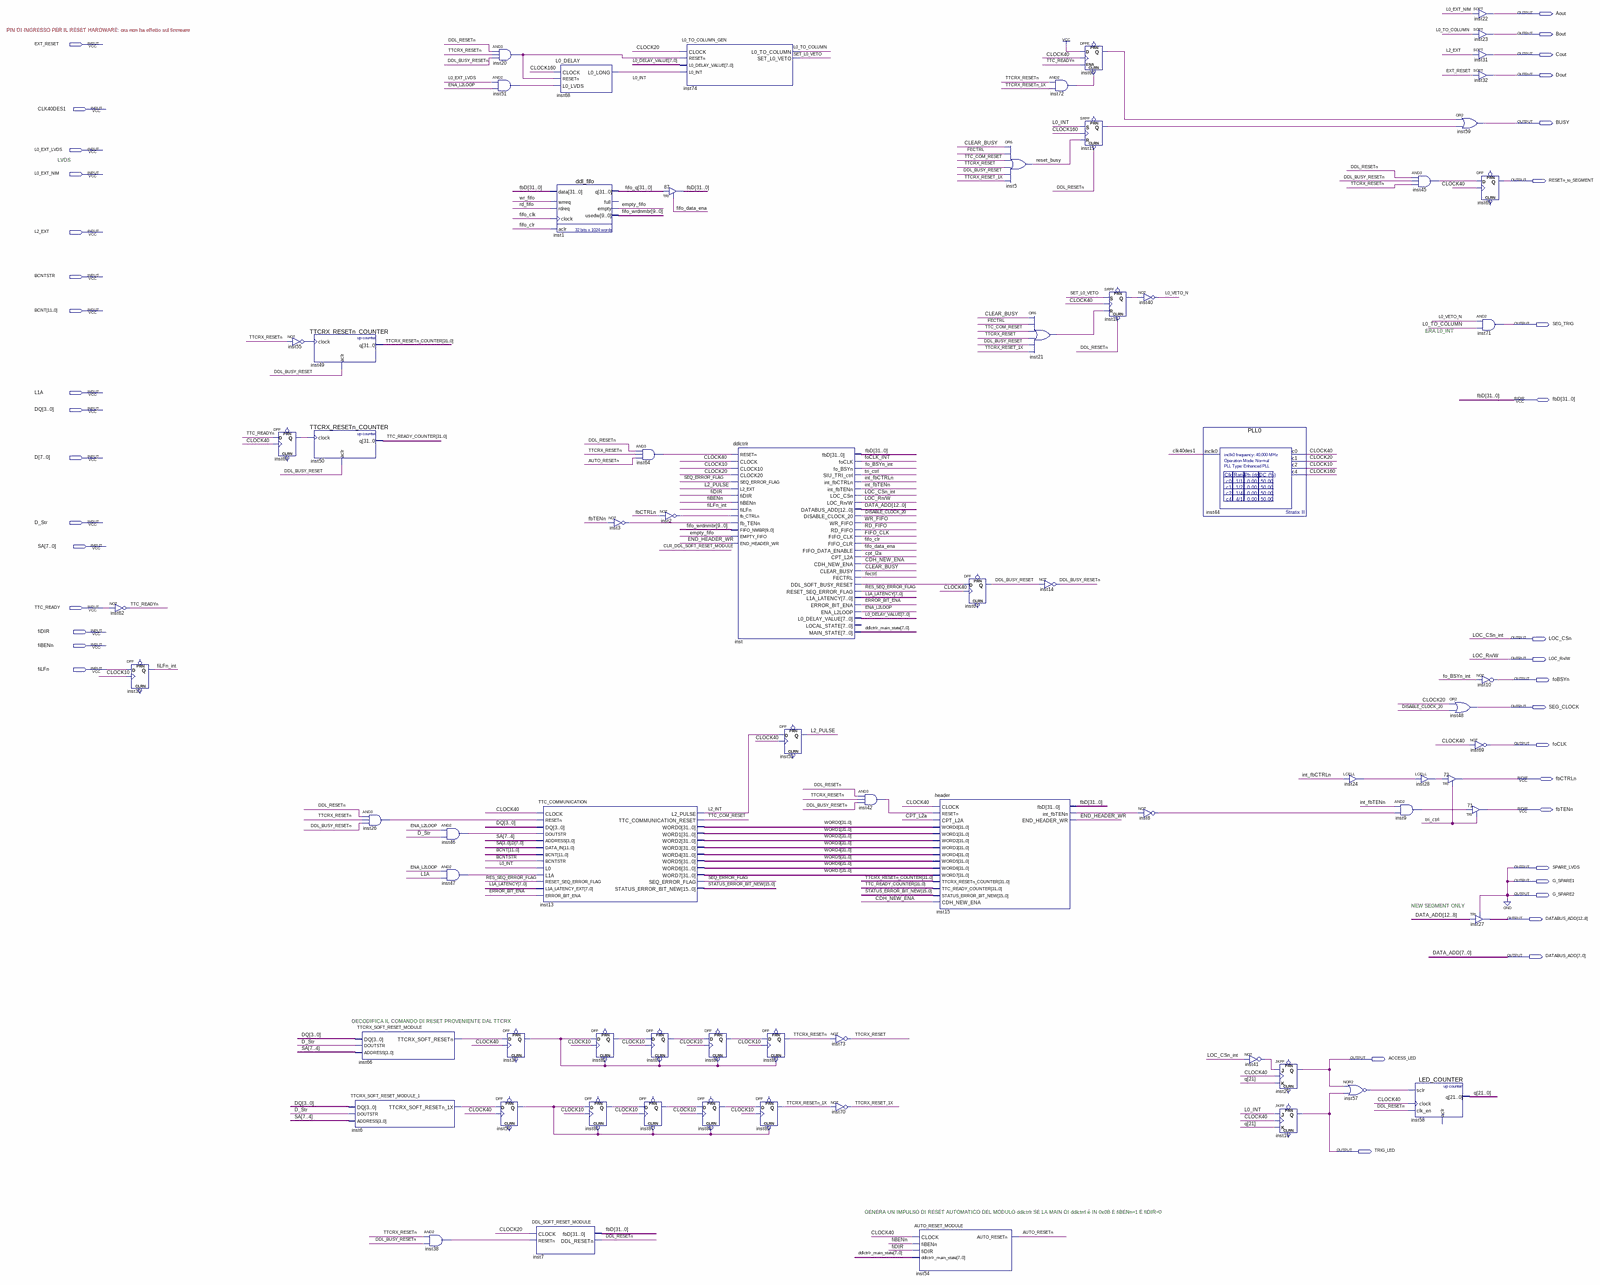
[diagram p0: schematic sheet, whole]
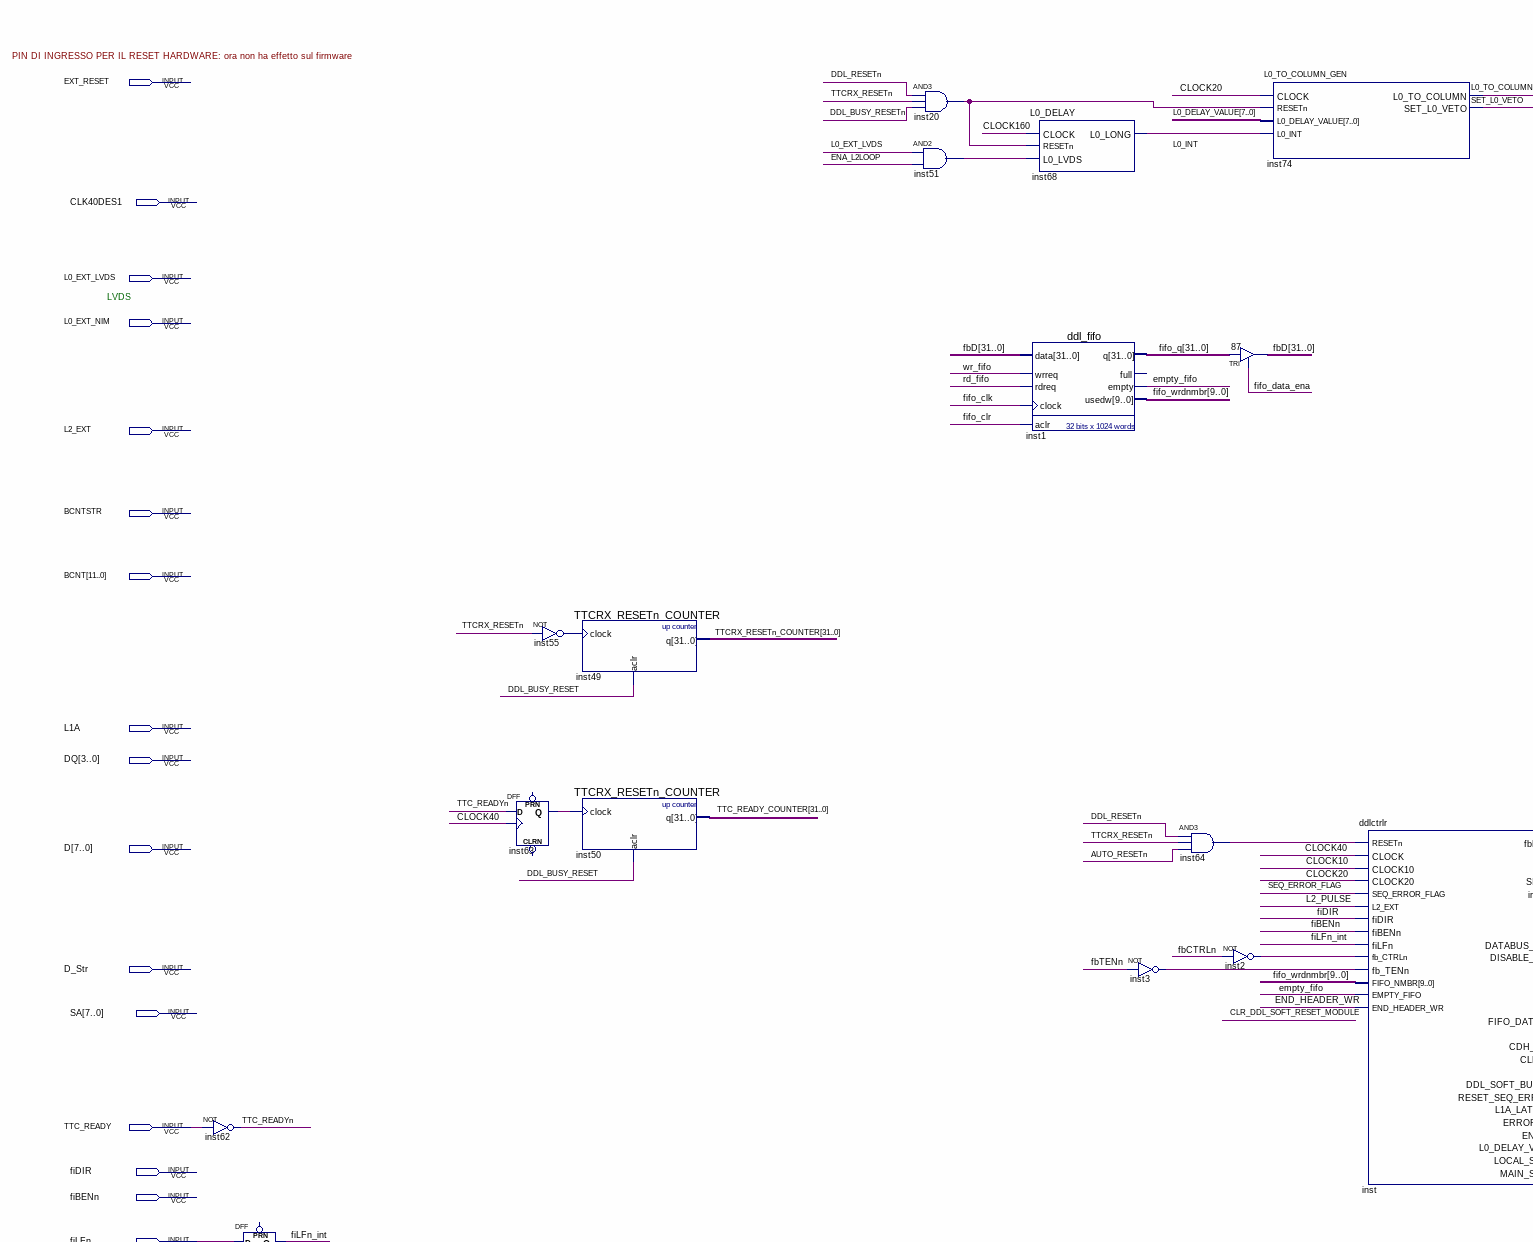
[diagram p1: schematic sheet, upper left part]
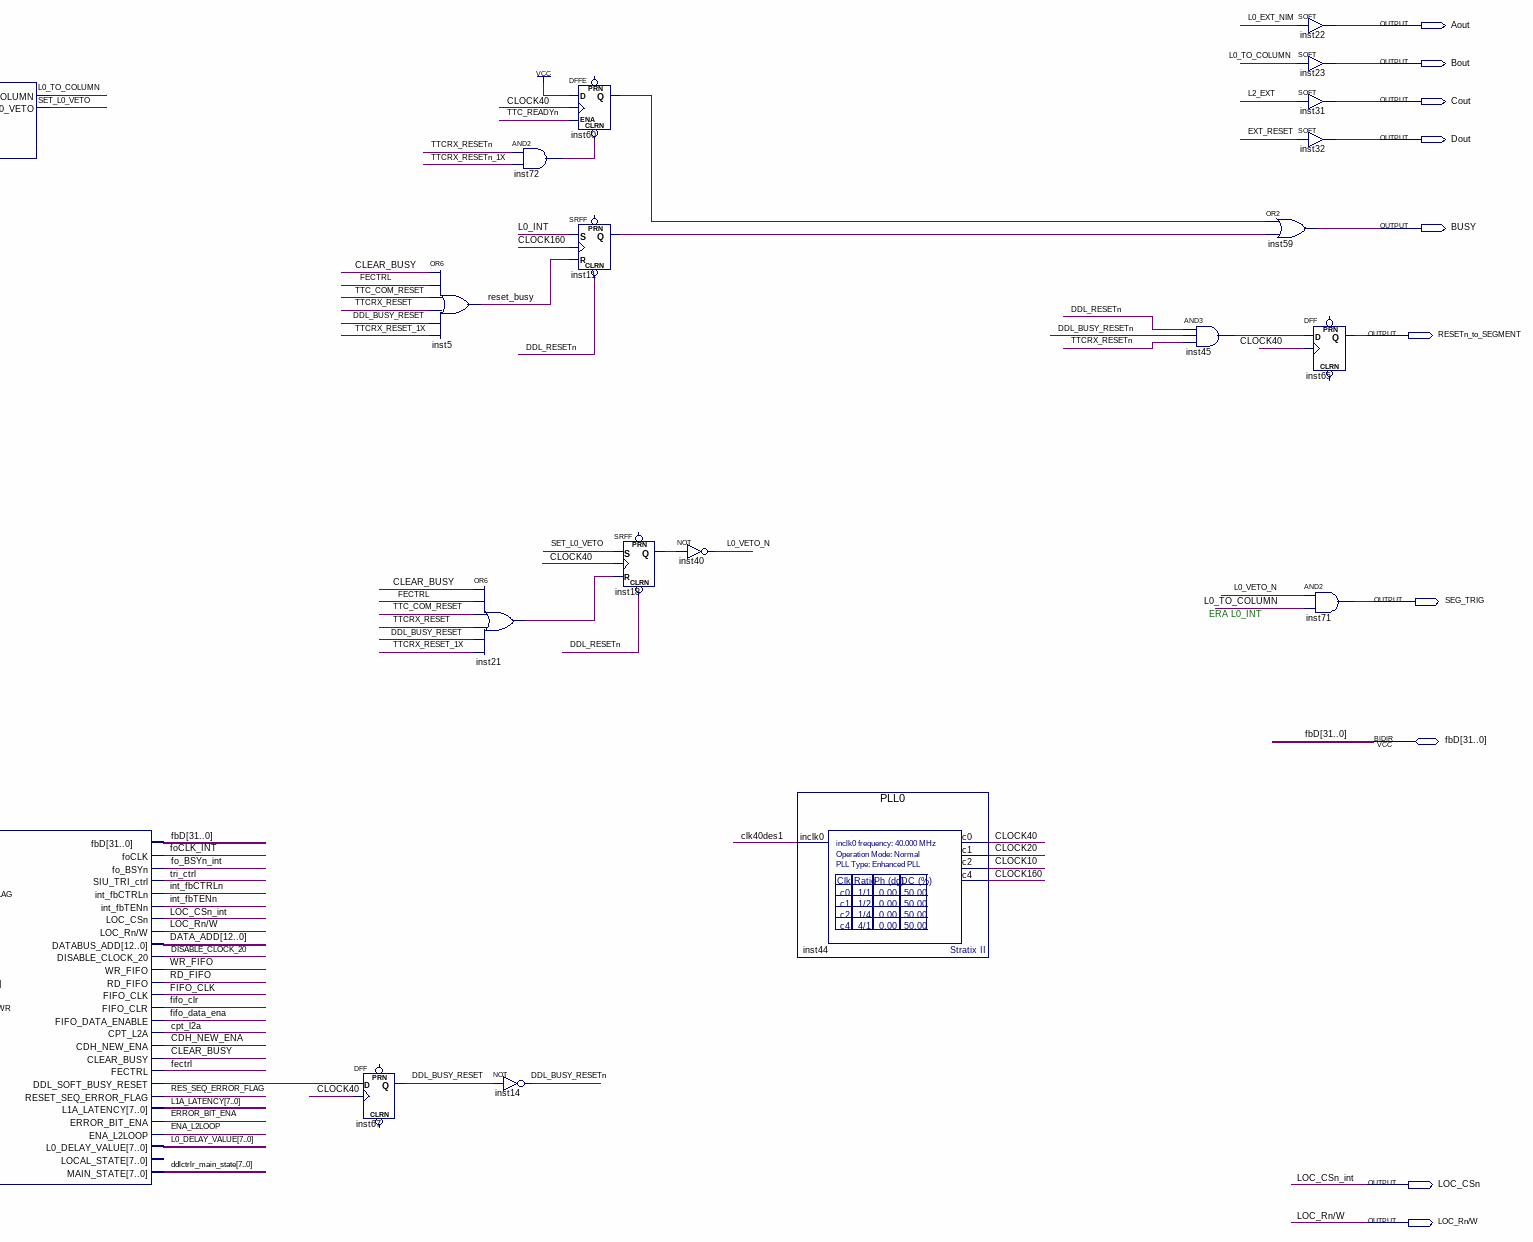
[diagram p2: schematic sheet, upper right part]
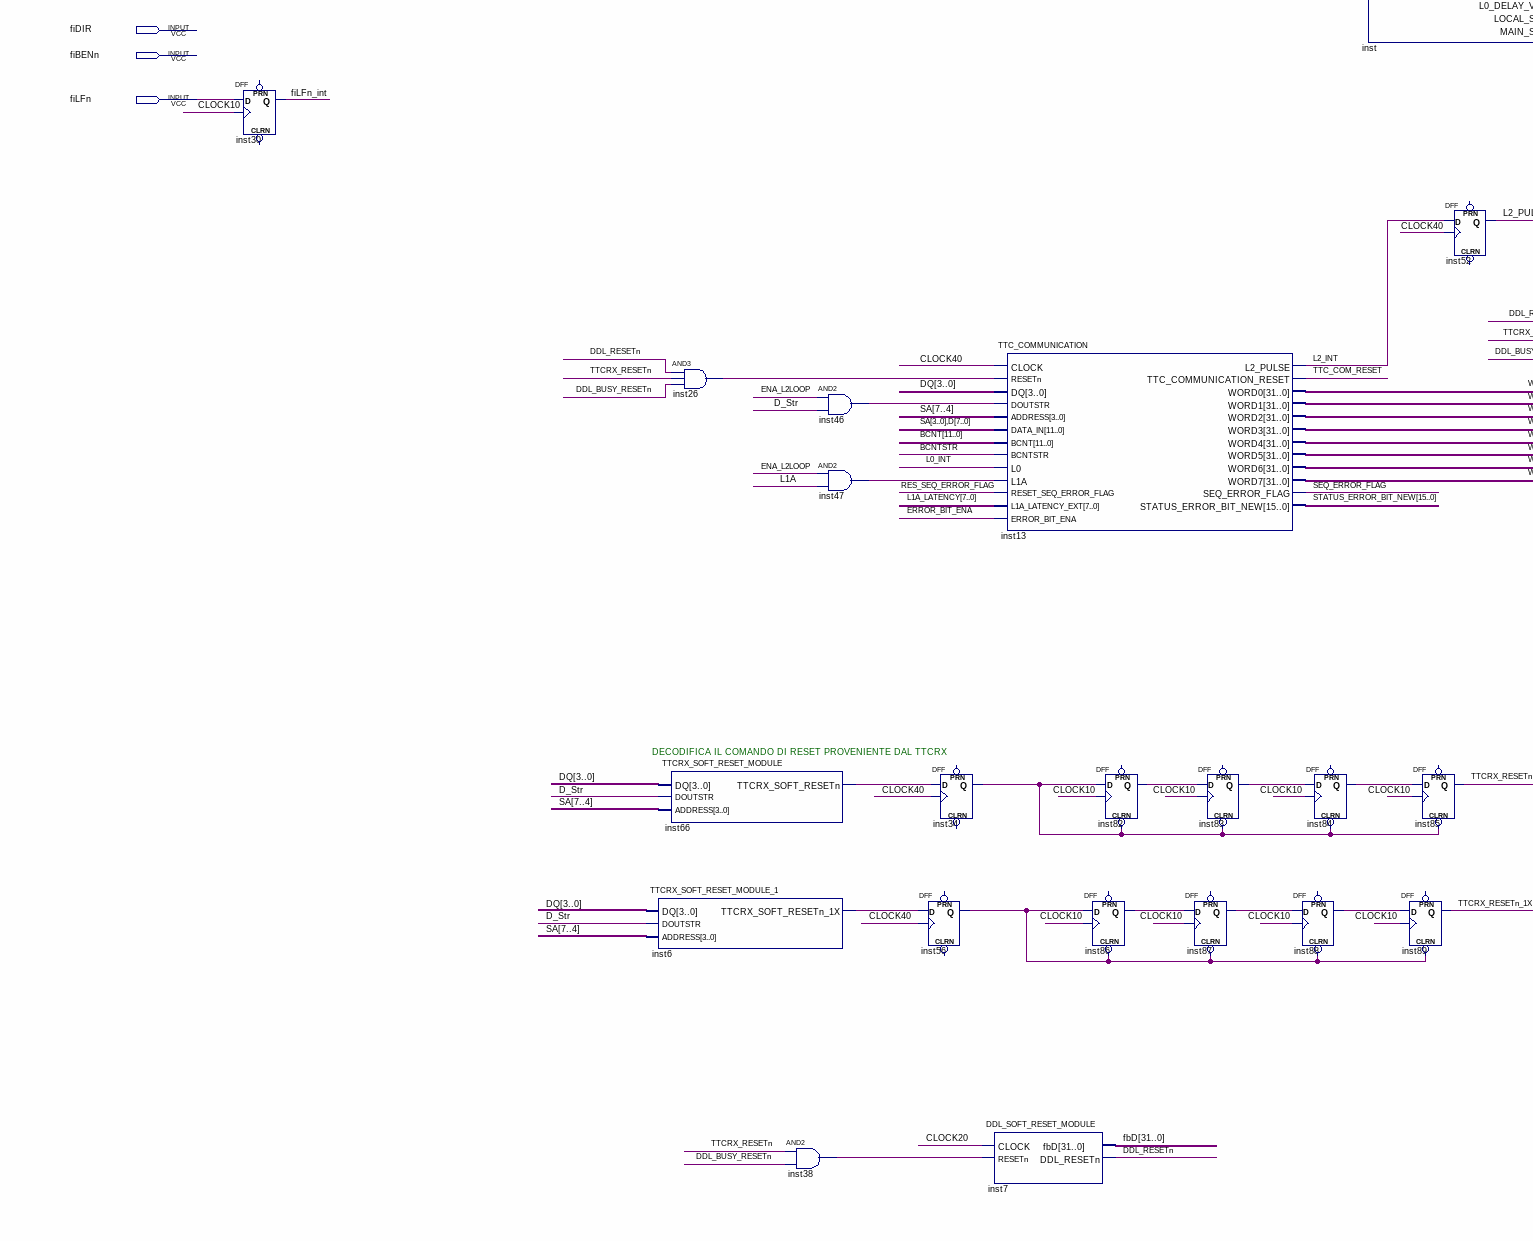
[diagram p3: schematic sheet, lower left part]
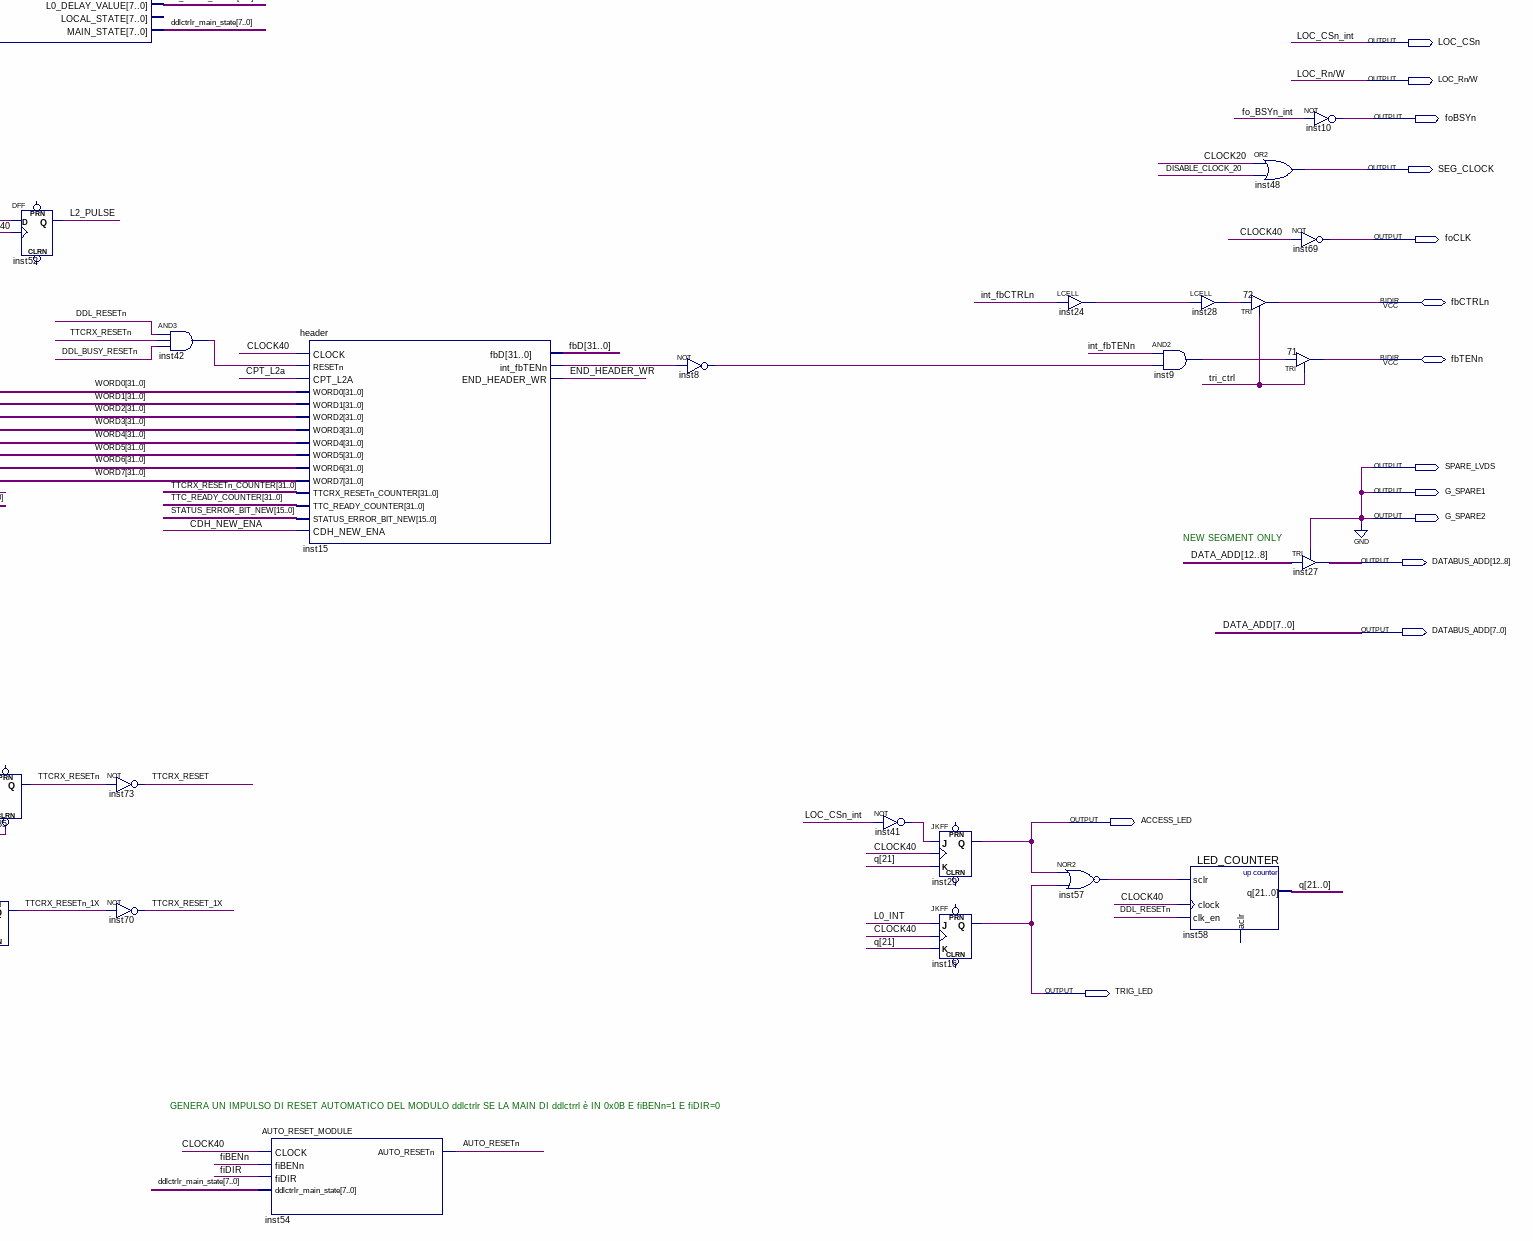
[diagram p4: schematic sheet, lower right part]
// Quartus schematic ddl_ctrlr.bdf as structural Verilog: 73 symbols, 38 pins
module ddl_ctrlr (
  input  EXT_RESET,
  input  CLK40DES1,
  input  L0_EXT_LVDS,
  input  L0_EXT_NIM,
  input  L2_EXT,
  input  BCNTSTR,
  input  [11:0] BCNT,
  input  L1A,
  input  [3:0] DQ,
  input  [7:0] D,
  input  D_Str,
  input  [7:0] SA,
  input  TTC_READY,
  input  fiDIR,
  input  fiBENn,
  input  fiLFn,
  inout  [31:0] fbD,
  inout  fbCTRLn,
  inout  fbTENn,
  output Aout,
  output Bout,
  output Cout,
  output Dout,
  output BUSY,
  output RESETn_to_SEGMENT,
  output SEG_TRIG,
  output LOC_CSn,
  output \LOC_Rn/W ,
  output foBSYn,
  output SEG_CLOCK,
  output foCLK,
  output SPARE_LVDS,
  output G_SPARE1,
  output G_SPARE2,
  output [12:0] DATABUS_ADD,
  output ACCESS_LED,
  output TRIG_LED
);

  wire AUTO_RESETn, CDH_NEW_ENA, CLEAR_BUSY, CLOCK10, CLOCK20, CLOCK40, CLOCK160, CPT_L2a, DDL_BUSY_RESET,
       DDL_BUSY_RESETn, DDL_RESETn, DISABLE_CLOCK_20, empty_fifo, ENA_L2LOOP, END_HEADER_WR, ERROR_BIT_ENA,
       fectrl, FIFO_CLK, fifo_clr, fifo_data_ena, fiLFn_int, fo_BSYn_int, foCLK_INT, inst2_out, inst3_out,
       inst6_ttcrx_soft_resetn_1x, inst8_out, inst9_out, inst11_q, inst15_int_fbtenn, inst18_q, inst20_out,
       inst21_out, inst24_out, inst26_out, inst28_out, inst34_q, inst38_out, inst41_out, inst42_out,
       inst45_out, inst46_out, inst47_out, inst51_out, inst55_out, inst56_q, inst57_out, inst60_q, inst63_q,
       inst64_out, inst66_ttcrx_soft_resetn, inst72_out, inst82_q, inst83_q, inst84_q, inst86_q, inst87_q,
       inst88_q, inst_ddl_soft_busy_reset, int_fbCTRLn, int_fbTENn, L0_INT, L0_TO_COLUMN, L0_VETO_N, L2_INT,
       L2_PULSE, RD_FIFO, RES_SEQ_ERROR_FLAG, reset_busy, SEQ_ERROR_FLAG, SET_L0_VETO, tri_ctrl,
       TTC_COM_RESET, TTC_READYn, TTCRX_RESET, TTCRX_RESET_1X, TTCRX_RESETn, TTCRX_RESETn_1X, WR_FIFO;
  wire [7:0] ddlctrlr_main_state, L0_DELAY_VALUE, L1A_LATENCY;
  wire [9:0] fifo_wrdnmbr;
  wire [12:8] DATA_ADD;
  wire [15:0] STATUS_ERROR_BIT_NEW;
  wire [21:0] q;
  wire [31:0] fifo_q, TTC_READY_COUNTER, TTCRX_RESETn_COUNTER, WORD0, WORD1, WORD2, WORD3, WORD4, WORD5,
       WORD6, WORD7;

  not inst62 (TTC_READYn, TTC_READY);
  DFF inst30 (.CLK(CLOCK10), .D(fiLFn), .Q(fiLFn_int));  // open: CLRN, PRN
  not inst55 (inst55_out, TTCRX_RESETn);
  DFF inst63 (.CLK(CLOCK40), .D(TTC_READYn), .Q(inst63_q));  // open: CLRN, PRN
  TTCRX_RESETn_COUNTER inst49 (.clock(inst55_out), .aclr(DDL_BUSY_RESET), .q(TTCRX_RESETn_COUNTER));
  TTCRX_RESETn_COUNTER inst50 (.clock(inst63_q), .aclr(DDL_BUSY_RESET), .q(TTC_READY_COUNTER));
  and inst26 (inst26_out, DDL_RESETn, TTCRX_RESETn, DDL_BUSY_RESETn);
  TTCRX_SOFT_RESET_MODULE inst66 (
    .DQ(DQ), .DOUTSTR(D_Str), .ADDRESS(SA[7:4]), .TTCRX_SOFT_RESETn(inst66_ttcrx_soft_resetn));
  TTCRX_SOFT_RESET_MODULE_1 inst6 (
    .DQ(DQ), .DOUTSTR(D_Str), .ADDRESS(SA[7:4]), .TTCRX_SOFT_RESETn_1X(inst6_ttcrx_soft_resetn_1x));
  and inst38 (inst38_out, TTCRX_RESETn, DDL_BUSY_RESETn);
  and inst46 (inst46_out, ENA_L2LOOP, D_Str);
  and inst47 (inst47_out, ENA_L2LOOP, L1A);
  and inst20 (inst20_out, DDL_RESETn, TTCRX_RESETn, DDL_BUSY_RESETn);
  and inst51 (inst51_out, L0_EXT_LVDS, ENA_L2LOOP);
  DFF inst34 (.CLK(CLOCK40), .D(inst66_ttcrx_soft_resetn), .Q(inst34_q));  // open: CLRN, PRN
  DFF inst56 (.CLK(CLOCK40), .D(inst6_ttcrx_soft_resetn_1x), .Q(inst56_q));  // open: CLRN, PRN
  DDL_SOFT_RESET_MODULE inst7 (.CLOCK(CLOCK20), .RESETn(inst38_out), .DDL_RESETn(DDL_RESETn), .fbD(fbD));
  L0_DELAY inst68 (.CLOCK(CLOCK160), .RESETn(inst20_out), .L0_LVDS(inst51_out), .L0_LONG(L0_INT));
  ddl_fifo inst1 (
    .data(fbD), .wrreq(WR_FIFO), .rdreq(RD_FIFO), .clock(FIFO_CLK), .aclr(fifo_clr), .q(fifo_q),
    .empty(empty_fifo), .usedw(fifo_wrdnmbr));  // open: full
  TTC_COMMUNICATION inst13 (
    .CLOCK(CLOCK40), .RESETn(inst26_out), .DQ(DQ), .DOUTSTR(inst46_out), .ADDRESS(SA[7:4]),
    .DATA_IN({SA[3:0], D}), .BCNT(BCNT), .BCNTSTR(BCNTSTR), .L0(L0_INT), .L1A(inst47_out),
    .RESET_SEQ_ERROR_FLAG(RES_SEQ_ERROR_FLAG), .L1A_LATENCY_EXT(L1A_LATENCY), .ERROR_BIT_ENA(ERROR_BIT_ENA),
    .L2_PULSE(L2_INT), .TTC_COMMUNICATION_RESET(TTC_COM_RESET), .WORD0(WORD0), .WORD1(WORD1), .WORD2(WORD2),
    .WORD3(WORD3), .WORD4(WORD4), .WORD5(WORD5), .WORD6(WORD6), .WORD7(WORD7),
    .SEQ_ERROR_FLAG(SEQ_ERROR_FLAG), .STATUS_ERROR_BIT_NEW(STATUS_ERROR_BIT_NEW));
  DFF inst86 (.CLRN(inst56_q), .CLK(CLOCK10), .D(inst56_q), .Q(inst86_q));  // open: PRN
  not inst3 (inst3_out, fbTENn);
  DFF inst82 (.CLRN(inst34_q), .CLK(CLOCK10), .D(inst34_q), .Q(inst82_q));  // open: PRN
  and inst64 (inst64_out, DDL_RESETn, TTCRX_RESETn, AUTO_RESETn);
  DFF inst87 (.CLRN(inst56_q), .CLK(CLOCK10), .D(inst86_q), .Q(inst87_q));  // open: PRN
  TRI u_87[31:0] (.IN(fifo_q), .OE(fifo_data_ena), .OUT(fbD));
  not inst2 (inst2_out, fbCTRLn);
  DFF inst83 (.CLRN(inst34_q), .CLK(CLOCK10), .D(inst82_q), .Q(inst83_q));  // open: PRN
  L0_TO_COLUMN_GEN inst74 (
    .CLOCK(CLOCK20), .RESETn(inst20_out), .L0_DELAY_VALUE(L0_DELAY_VALUE), .L0_INT(L0_INT),
    .L0_TO_COLUMN(L0_TO_COLUMN), .SET_L0_VETO(SET_L0_VETO));
  DFF inst88 (.CLRN(inst56_q), .CLK(CLOCK10), .D(inst87_q), .Q(inst88_q));  // open: PRN
  DFF inst84 (.CLRN(inst34_q), .CLK(CLOCK10), .D(inst83_q), .Q(inst84_q));  // open: PRN
  ddlctrlr inst (
    .RESETn(inst64_out), .CLOCK(CLOCK40), .CLOCK10(CLOCK10), .CLOCK20(CLOCK20),
    .SEQ_ERROR_FLAG(SEQ_ERROR_FLAG), .L2_EXT(L2_PULSE), .fiDIR(fiDIR), .fiBENn(fiBENn), .fiLFn(fiLFn_int),
    .fb_CTRLn(inst2_out), .fb_TENn(inst3_out), .FIFO_NMBR(fifo_wrdnmbr), .EMPTY_FIFO(empty_fifo),
    .END_HEADER_WR(END_HEADER_WR), .foCLK(foCLK_INT), .fo_BSYn(fo_BSYn_int), .SIU_TRI_ctrl(tri_ctrl),
    .int_fbCTRLn(int_fbCTRLn), .int_fbTENn(int_fbTENn), .LOC_CSn(LOC_CSn), .\LOC_Rn/W (\LOC_Rn/W ),
    .DATABUS_ADD({DATA_ADD, DATABUS_ADD[7:0]}), .DISABLE_CLOCK_20(DISABLE_CLOCK_20), .WR_FIFO(WR_FIFO),
    .RD_FIFO(RD_FIFO), .FIFO_CLK(FIFO_CLK), .FIFO_CLR(fifo_clr), .FIFO_DATA_ENABLE(fifo_data_ena),
    .CPT_L2A(CPT_L2a), .CDH_NEW_ENA(CDH_NEW_ENA), .CLEAR_BUSY(CLEAR_BUSY), .FECTRL(fectrl),
    .DDL_SOFT_BUSY_RESET(inst_ddl_soft_busy_reset), .RESET_SEQ_ERROR_FLAG(RES_SEQ_ERROR_FLAG),
    .L1A_LATENCY(L1A_LATENCY), .ERROR_BIT_ENA(ERROR_BIT_ENA), .ENA_L2LOOP(ENA_L2LOOP),
    .L0_DELAY_VALUE(L0_DELAY_VALUE), .MAIN_STATE(ddlctrlr_main_state), .fbD(fbD));  // open: LOCAL_STATE
  DFF inst52 (.CLK(CLOCK40), .D(L2_INT), .Q(L2_PULSE));  // open: CLRN, PRN
  DFF inst85 (.CLRN(inst34_q), .CLK(CLOCK10), .D(inst84_q), .Q(TTCRX_RESETn));  // open: PRN
  DFF inst89 (.CLRN(inst56_q), .CLK(CLOCK10), .D(inst88_q), .Q(TTCRX_RESETn_1X));  // open: PRN
  not inst73 (TTCRX_RESET, TTCRX_RESETn);
  not inst70 (TTCRX_RESET_1X, TTCRX_RESETn_1X);
  and inst42 (inst42_out, DDL_RESETn, TTCRX_RESETn, DDL_BUSY_RESETn);
  AUTO_RESET_MODULE inst54 (
    .CLOCK(CLOCK40), .fiBENn(fiBENn), .fiDIR(fiDIR), .ddlctrlr_main_state(ddlctrlr_main_state),
    .AUTO_RESETn(AUTO_RESETn));
  header inst15 (
    .CLOCK(CLOCK40), .RESETn(inst42_out), .CPT_L2A(CPT_L2a), .WORD0(WORD0), .WORD1(WORD1), .WORD2(WORD2),
    .WORD3(WORD3), .WORD4(WORD4), .WORD5(WORD5), .WORD6(WORD6), .WORD7(WORD7),
    .TTCRX_RESETn_COUNTER(TTCRX_RESETn_COUNTER), .TTC_READY_COUNTER(TTC_READY_COUNTER),
    .STATUS_ERROR_BIT_NEW(STATUS_ERROR_BIT_NEW), .CDH_NEW_ENA(CDH_NEW_ENA), .int_fbTENn(inst15_int_fbtenn),
    .END_HEADER_WR(END_HEADER_WR), .fbD(fbD));
  DFF inst67 (.CLK(CLOCK40), .D(inst_ddl_soft_busy_reset), .Q(DDL_BUSY_RESET));  // open: CLRN, PRN
  or inst5 (reset_busy, CLEAR_BUSY, fectrl, TTC_COM_RESET, TTCRX_RESET, DDL_BUSY_RESET, TTCRX_RESET_1X);
  and inst72 (inst72_out, TTCRX_RESETn, TTCRX_RESETn_1X);
  or inst21 (inst21_out, CLEAR_BUSY, fectrl, TTC_COM_RESET, TTCRX_RESET, DDL_BUSY_RESET, TTCRX_RESET_1X);
  not inst14 (DDL_BUSY_RESETn, DDL_BUSY_RESET);
  DFFE inst60 (.CLRN(inst72_out), .D(1'b1), .CLK(CLOCK40), .ENA(TTC_READYn), .Q(inst60_q));  // open: PRN
  SRFF inst11 (.CLRN(DDL_RESETn), .S(L0_INT), .R(reset_busy), .CLK(CLOCK160), .Q(inst11_q));  // open: PRN
  SRFF inst18 (.CLRN(DDL_RESETn), .S(SET_L0_VETO), .R(inst21_out), .CLK(CLOCK40), .Q(inst18_q));  // open: PRN
  not inst40 (L0_VETO_N, inst18_q);
  not inst8 (inst8_out, inst15_int_fbtenn);
  PLL0 inst44 (.inclk0(CLK40DES1), .c0(CLOCK40), .c1(CLOCK20), .c2(CLOCK10), .c4(CLOCK160));
  not inst41 (inst41_out, LOC_CSn);
  JKFF inst29 (.K(q[21]), .J(inst41_out), .CLK(CLOCK40), .Q(ACCESS_LED));  // open: PRN, CLRN
  JKFF inst16 (.K(q[21]), .J(L0_INT), .CLK(CLOCK40), .Q(TRIG_LED));  // open: PRN, CLRN
  LCELL inst24 (.IN(int_fbCTRLn), .OUT(inst24_out));
  nor inst57 (inst57_out, ACCESS_LED, TRIG_LED);
  and inst9 (inst9_out, int_fbTENn, inst8_out);
  LED_COUNTER inst58 (.sclr(inst57_out), .clock(CLOCK40), .clk_en(DDL_RESETn), .q(q));  // open: aclr
  and inst45 (inst45_out, DDL_RESETn, DDL_BUSY_RESETn, TTCRX_RESETn);
  LCELL inst28 (.IN(inst24_out), .OUT(inst28_out));
  or inst59 (BUSY, inst60_q, inst11_q);
  or inst48 (SEG_CLOCK, CLOCK20, DISABLE_CLOCK_20);
  TRI u_72 (.IN(inst28_out), .OE(tri_ctrl), .OUT(fbCTRLn));
  SOFT inst22 (.IN(L0_EXT_NIM), .OUT(Aout));
  SOFT inst23 (.IN(L0_TO_COLUMN), .OUT(Bout));
  SOFT inst31 (.IN(L2_EXT), .OUT(Cout));
  SOFT inst32 (.IN(EXT_RESET), .OUT(Dout));
  DFF inst65 (.CLK(CLOCK40), .D(inst45_out), .Q(RESETn_to_SEGMENT));  // open: CLRN, PRN
  and inst71 (SEG_TRIG, L0_VETO_N, L0_TO_COLUMN);
  not inst10 (foBSYn, fo_BSYn_int);
  not inst69 (foCLK, CLOCK40);
  TRI u_71 (.IN(inst9_out), .OE(tri_ctrl), .OUT(fbTENn));
  TRI inst27[4:0] (.IN(DATA_ADD), .OE(1'b0), .OUT(DATABUS_ADD[12:8]));

  assign G_SPARE1 = 1'b0;
  assign G_SPARE2 = 1'b0;
  assign SPARE_LVDS = 1'b0;

  // Other names for the same wires on the sheet: DATA_ADD[7:0] = DATABUS_ADD[7:0]; LOC_CSn_int = LOC_CSn

  // Notes on the sheet:
  //   PIN DI INGRESSO PER IL RESET HARDWARE: ora non ha effetto sul firmware
  //   LVDS
  //   ERA L0_INT
  //   NEW SEGMENT ONLY
  //   DECODIFICA IL COMANDO DI RESET PROVENIENTE DAL TTCRX
  //   GENERA UN IMPULSO DI RESET AUTOMATICO DEL MODULO ddlctrlr SE LA MAIN DI ddlctrrl è IN 0x0B E fiBENn=1 E fiDIR=0
endmodule
